# Altium project 数据记录仪.PrjPcb
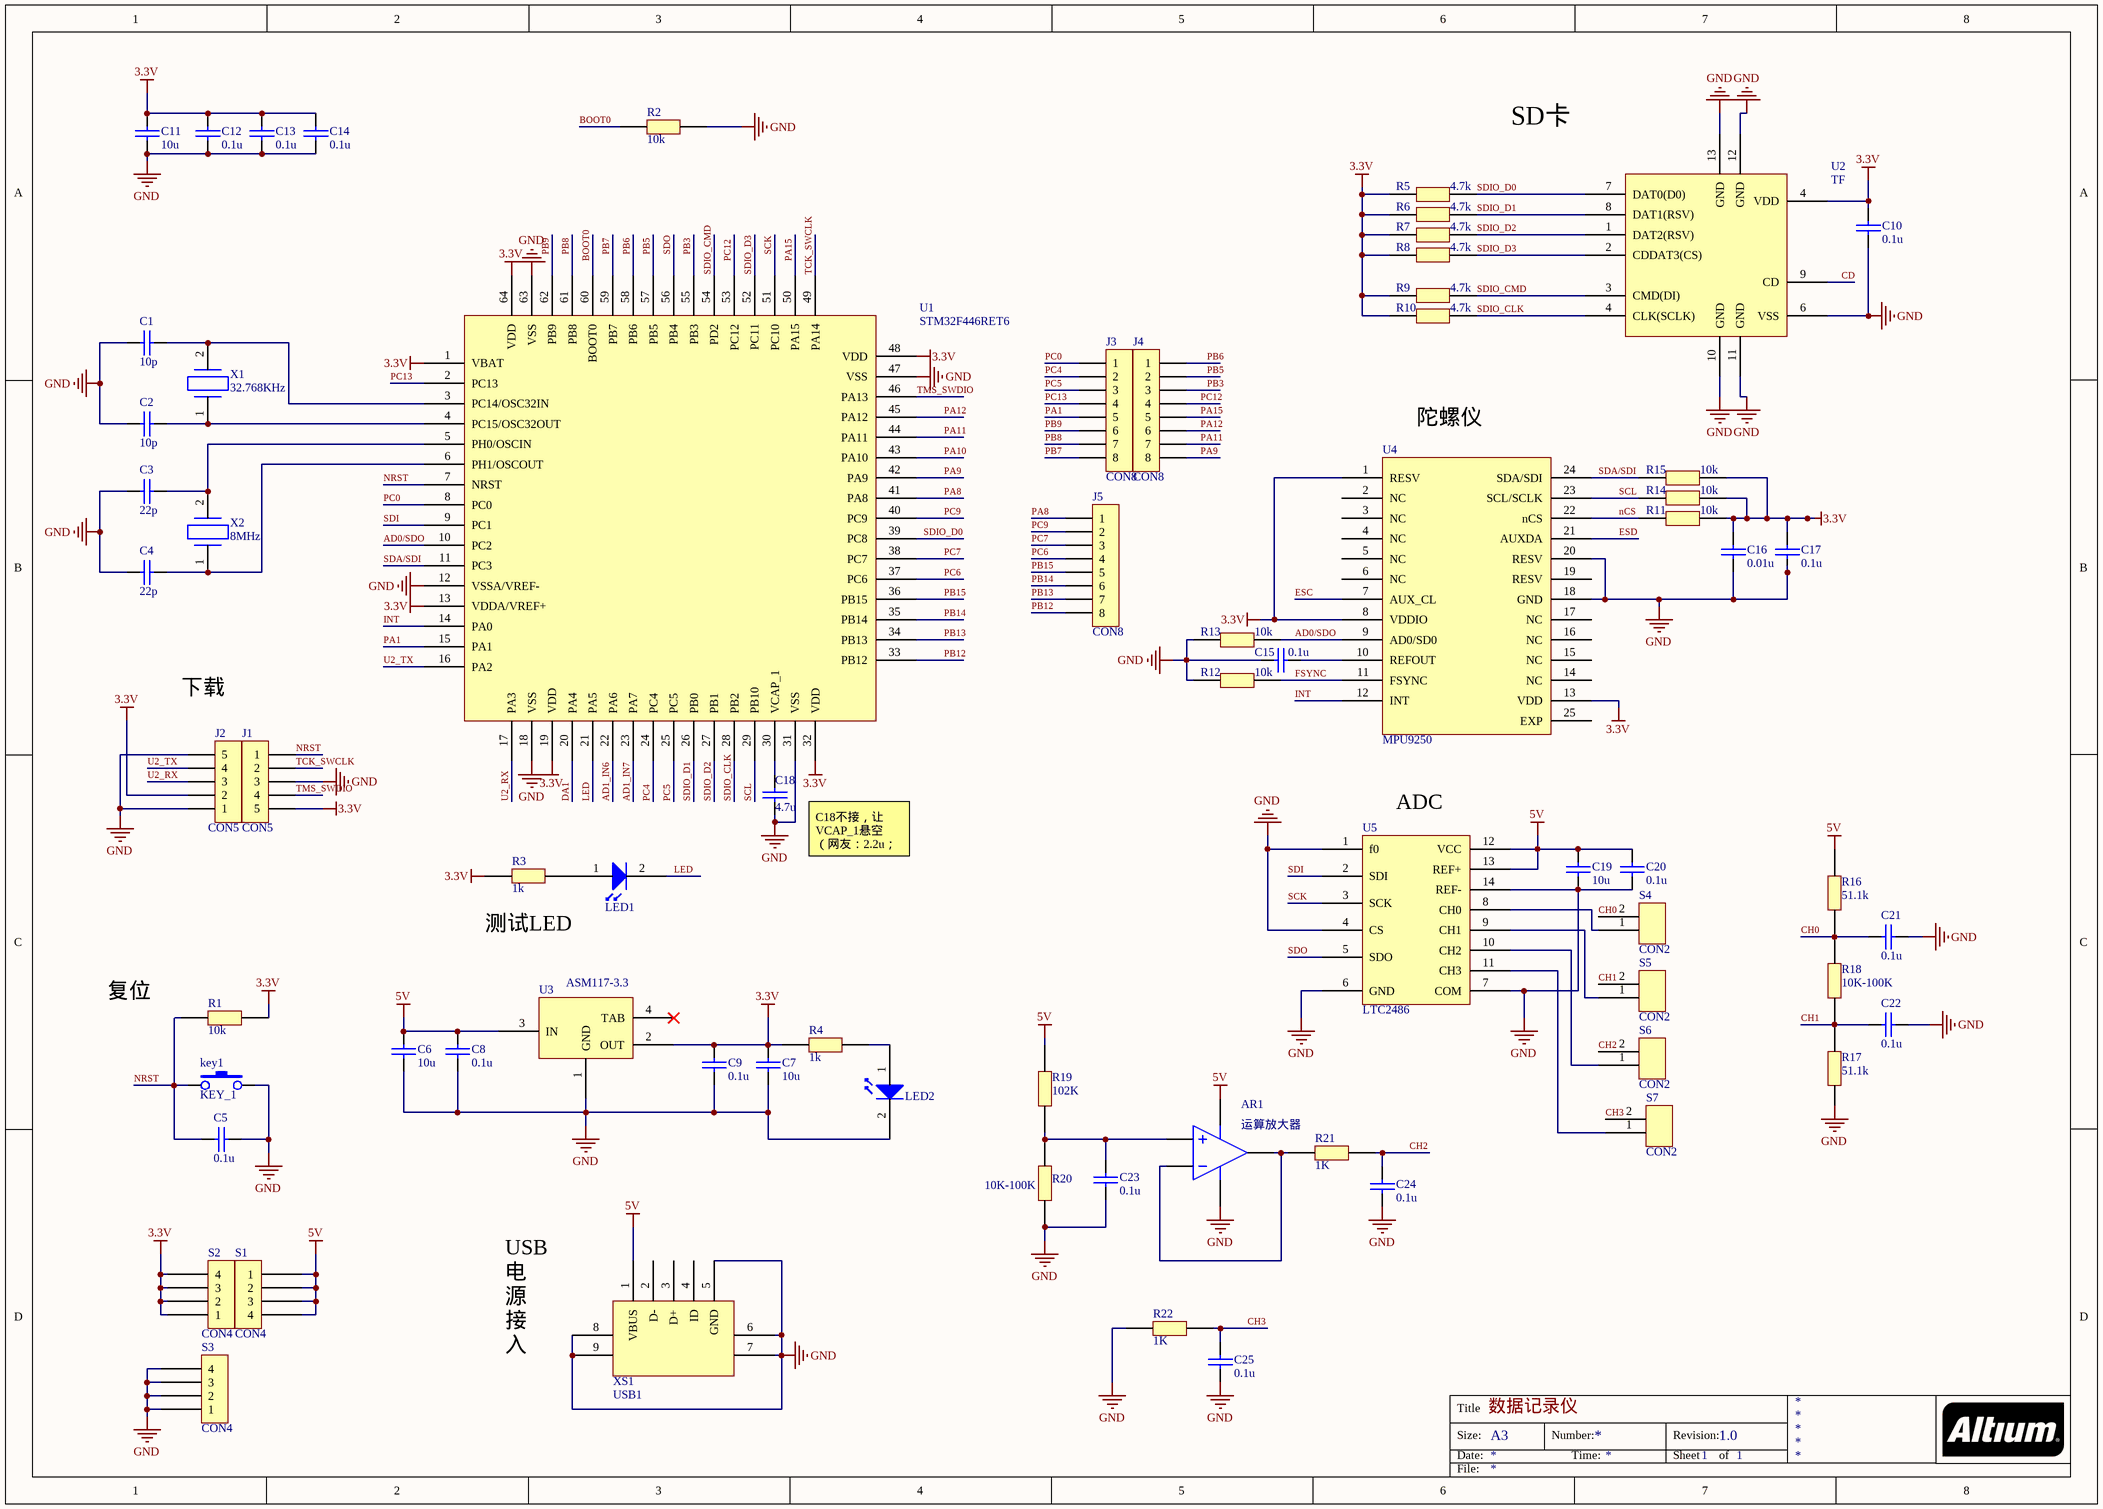
[diagram p0: 数据记录仪.SchDoc]
1 sheet, 71 parts. Net scope: global (net labels, ports and power ports of the same name join across sheets).
Board file: 数据记录仪.PcbDoc

## Sheet 数据记录仪.SchDoc: 数据记录仪
size A3; Date: 2019/1/1; Revision: 1.0; SheetNumber: 1; SheetTotal: 1

### Parts
AR1  运算放大器  [MSOP-8]
C1  10p  [0603-cap]
C2  10p  [0603-cap]
C3  22p  [0603-cap]
C4  22p  [0603-cap]
C5  0.1u  [0603-cap]
C6  10u  [0603-cap]
C7  10u  [0603-cap]
C8  0.1u  [0603-cap]
C9  0.1u  [0603-cap]
C10  0.1u  [0603-cap]
C11  10u  [0603-cap]
C12  0.1u  [0603-cap]
C13  0.1u  [0603-cap]
C14  0.1u  [0603-cap]
C15  0.1u  [0603-cap]
C16  0.01u  [0603-cap]
C17  0.1u  [0603-cap]
C18  4.7u  [0603-cap]
C19  10u  [0603-cap]
C20  0.1u  [0603-cap]
C21  0.1u  [0603-cap]
C22  0.1u  [0603-cap]
C23  0.1u  [0603-cap]
C24  0.1u  [0603-cap]
C25  0.1u  [0603-cap]
J1  CON5  [SIP05]
J2  CON5  [SIP05]
J3  CON8  [SIP08]
J4  CON8  [SIP08]
J5  CON8  [SIP08]
key1  KEY_1  [key - duplicate5]
LED1  LED?  [LED]  (value not drawn)
LED2  LED?  [LED]  (value not drawn)
R1  10k  [0603-res]
R2  10k  [0603-res]
R3  1k  [0603-res]
R4  1k  [0603-res]
R5  4.7k  [0603-res]
R6  4.7k  [0603-res]
R7  4.7k  [0603-res]
R8  4.7k  [0603-res]
R9  4.7k  [0603-res]
R10  4.7k  [0603-res]
R11  10k  [0603-res]
R12  10k  [0603-res]
R13  10k  [0603-res]
R14  10k  [0603-res]
R15  10k  [0603-res]
R16  51.1k  [0603-res]
R17  51.1k  [0603-res]
R18  10K-100K  [0603-res]
R19  102K  [0603-res]
R20  10K-100K  [0603-res]
R21  1K  [0603-res]
R22  1K  [0603-res]
S1  CON4  [SIP04]
S2  CON4  [SIP04]
S3  CON4  [SIP04]
S4  CON2  [SIP02]
S5  CON2  [SIP02]
S6  CON2  [SIP02]
S7  CON2  [SIP02]
U1  STM32F446RET6  [LQFP-64_10X10X05P]
U2  TF  [TF-01A]
U3  ASM117-3.3  [SOT-223]
U4  MPU9250  [QFN-24-1EP_3X3MM_PITCH0.4MM]
U5  LTC2486  [DFN14]
X1  32.768KHz  [XTAL2]
X2  8MHz  [XTAL2]
XS1  USB1  [micro USB]

### Nets
3.3V: C7.1 C9.1 C10.1 C11.1 C12.1 C13.1 C14.1 C16.2 C17.2 J1.5 J2.2 R1.1 R3.2 R4.1 R5.1 R6.1 R7.1 R8.1 R9.1 R10.1 R11.2 R14.2 R15.2 S2.1 S2.2 S2.3 S2.4 U1.1(VBAT) U1.13(VDDA/VREF+) U1.19(VDD) U1.32(VDD) U1.48(VDD) U1.64(VDD) U2.4(VDD) U3.2(OUT) U4.1(RESV) U4.8(VDDIO) U4.13(VDD)
5V: AR1.5(V-) C6.1 C8.1 C19.2 C20.2 R16.2 R19.2 S1.1 S1.2 S1.3 S1.4 U3.3(IN) U5.12(VCC) U5.13(REF+) XS1.1(VBUS)
GND: AR1.4(V+) C1.1 C2.1 C3.1 C4.1 C5.2 C6.2 C7.2 C8.2 C9.2 C10.2 C11.2 C12.2 C13.2 C14.2 C15.1 C16.1 C17.1 C18.1 C19.1 C20.1 C21.2 C22.1 C23.2 C24.2 C25.2 J1.3 J2.1 J2.5 key1.2 LED2.2 R2.1 R12.1 R13.1 R20.1 R22.2 S3.1 S3.2 S3.3 S3.4 U1.12(VSSA/VREF-) U1.18(VSS) U1.31(VSS) U1.47(VSS) U1.63(VSS) U2.6(VSS) U2.10(GND) U2.11(GND) U2.12(GND) U2.13(GND) U3.1(GND) U4.18(GND) U4.20(RESV) U5.1(f0) U5.4(CS) U5.6(GND) U5.7(COM) U5.14(REF-) XS1.5(GND) XS1.6 XS1.7 XS1.8 XS1.9
AD0/SDO: R13.2 U1.10(PC2) U4.9(AD0/SD0)
AD1_IN6: U1.22(PA6)
AD1_IN7: U1.23(PA7)
BOOT0: R2.2 U1.60(BOOT0)
CD: U2.9(CD)
CH0: C21.1 R16.1 R18.2 S4.2
CH1: C22.2 R17.2 R18.1 S5.2
CH2: C24.1 R21.1 S6.2
CH3: C25.1 R22.1 S7.2
DA1: U1.20(PA4)
ESC: U4.7(AUX_CL)
ESD: U4.21(AUXDA)
FSYNC: R12.2 U4.11(FSYNC)
INT: U1.14(PA0) U4.12(INT)
LED: LED1.2 U1.21(PA5)
nCS: R11.1 U4.22(nCS)
NRST: C5.1 J1.1 key1.1 R1.2 U1.7(NRST)
PA1: J3.5 U1.15(PA1)
PA8: J5.1 U1.41(PA8)
PA9: J4.8 U1.42(PA9)
PA10: U1.43(PA10)
PA11: J4.7 U1.44(PA11)
PA12: J4.6 U1.45(PA12)
PA15: J4.5 U1.50(PA15)
PB3: J4.3 U1.55(PB3)
PB5: J4.2 U1.57(PB5)
PB6: J4.1 U1.58(PB6)
PB7: J3.8 U1.59(PB7)
PB8: J3.7 U1.61(PB8)
PB9: J3.6 U1.62(PB9)
PB12: J5.8 U1.33(PB12)
PB13: J5.7 U1.34(PB13)
PB14: J5.6 U1.35(PB14)
PB15: J5.5 U1.36(PB15)
PC0: J3.1 U1.8(PC0)
PC4: J3.2 U1.24(PC4)
PC5: J3.3 U1.25(PC5)
PC6: J5.4 U1.37(PC6)
PC7: J5.3 U1.38(PC7)
PC9: J5.2 U1.40(PC9)
PC12: J4.4 U1.53(PC12)
PC13: J3.4 U1.2(PC13)
SCK: U1.51(PC10) U5.3(SCK)
SCL: R14.1 U1.29(PB10) U4.23(SCL/SCLK)
SDA/SDI: R15.1 U1.11(PC3) U4.24(SDA/SDI)
SDI: U1.9(PC1) U5.2(SDI)
SDIO_CLK: R10.2 U1.28(PB2) U2.4(CLK(SCLK))
SDIO_CMD: R9.2 U1.54(PD2) U2.3(CMD(DI))
SDIO_D0: R5.2 U1.39(PC8) U2.7(DAT0(D0))
SDIO_D1: R6.2 U1.26(PB0) U2.8(DAT1(RSV))
SDIO_D2: R7.2 U1.27(PB1) U2.1(DAT2(RSV))
SDIO_D3: R8.2 U1.52(PC11) U2.2(CDDAT3(CS))
SDO: U1.56(PB4) U5.5(SDO)
TCK_SWCLK: J1.2 U1.49(PA14)
TMS_SWDIO: J1.4 U1.46(PA13)
U2_RX: J2.3 U1.17(PA3)
U2_TX: J2.4 U1.16(PA2)
NetAR1_1: AR1.1(IN-) AR1.3(OUT) R21.2
NetAR1_2: AR1.2(IN+) C23.1 R19.1 R20.2
NetC1_2: C1.2 U1.3(PC14/OSC32IN) X1.2
NetC2_2: C2.2 U1.4(PC15/OSC32OUT) X1.1
NetC3_2: C3.2 U1.5(PH0/OSCIN) X2.2
NetC4_2: C4.2 U1.6(PH1/OSCOUT) X2.1
NetC15_2: C15.2 U4.10(REFOUT)
NetC18_2: C18.2 U1.30(VCAP_1)
NetLED1_1: LED1.1 R3.1
NetLED2_1: LED2.1 R4.2
NetS4_1: S4.1 U5.8(CH0)
NetS5_1: S5.1 U5.9(CH1)
NetS6_1: S6.1 U5.10(CH2)
NetS7_1: S7.1 U5.11(CH3)

Not connected (* = marked no-connect by the designer): R17 1; U3 4(TAB)*; U4 2(NC) 3(NC) 4(NC) 5(NC) 6(NC) 14(NC) 15(NC) 16(NC) 17(NC) 19(RESV) 25(EXP); XS1 2(D-) 3(D+) 4(ID)

### Notes on the sheet
- SD卡
- (near U4) 陀螺仪
- 下载
- (near C18) C18不接，让VCAP_1悬空
  （网友：2.2u；手册4.7u）
- (near U5) ADC
- 测试LED
- (near R1) 复位
- USB电源接入
- Labels drawn without touching a wire or pin: GND
- Title
- Size:
- Date:
- A3
- Number:
- Time:
- Revision:
- Sheet
- of
- File:

### Library data of the parts
AR1 = 运算放大器: Operational Amplifier
C1-C25 = CAP
LED1 LED2 = LED
R1-R22 = RES
U2 = TF-01A
X1 X2 = XTAL